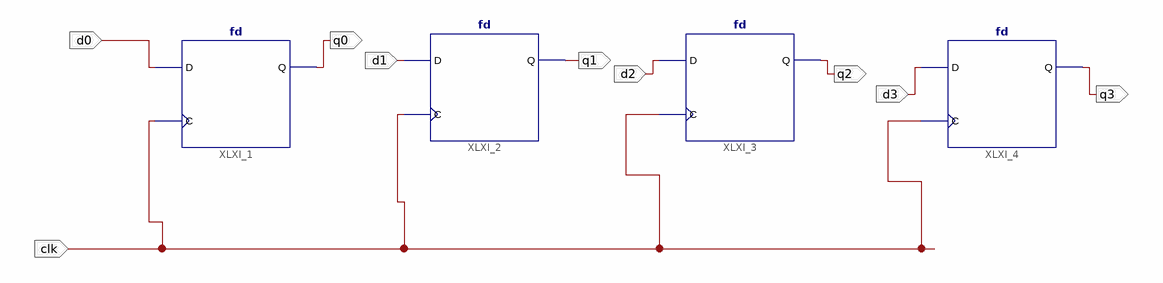
[diagram p0: schematic sheet 1]
// Xilinx ISE schematic registerlogic.sch (artix7) as structural Verilog: 4 symbols, 9 ports
module registerlogic (
  input  d0,
  input  clk,
  input  d1,
  input  d2,
  input  d3,
  output q0,
  output q1,
  output q2,
  output q3
);

  fd XLXI_1 (.C(clk), .D(d0), .Q(q0));
  fd XLXI_2 (.C(clk), .D(d1), .Q(q1));
  fd XLXI_3 (.C(clk), .D(d2), .Q(q2));
  fd XLXI_4 (.C(clk), .D(d3), .Q(q3));
endmodule
